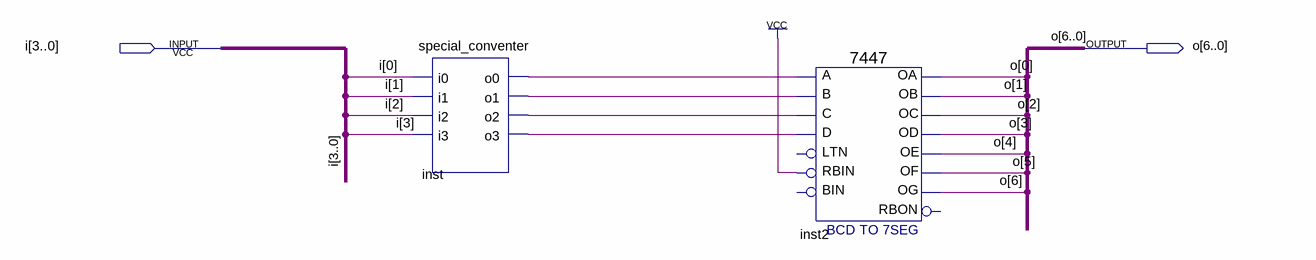
[diagram p0: schematic sheet]
// Quartus schematic main.bdf as structural Verilog: 2 symbols, 2 pins
module main (
  input  [3:0] i,
  output [6:0] o
);

  wire inst_o0, inst_o1, inst_o2, inst_o3;

  special_conventer inst (
    .i0(i[0]), .i1(i[1]), .i2(i[2]), .i3(i[3]), .o0(inst_o0), .o1(inst_o1), .o2(inst_o2), .o3(inst_o3));
  \7447  inst2 (
    .B(inst_o1), .C(inst_o2), .D(inst_o3), .RBIN(1'b1), .A(inst_o0), .OB(o[1]), .OC(o[2]), .OE(o[4]),
    .OD(o[3]), .OF(o[5]), .OG(o[6]), .OA(o[0]));  // open: LTN, BIN, RBON
endmodule
